# Altium schematic sheet 3v3Regulator.SchDoc
size B; SheetNumber: 5; SheetTotal: 6
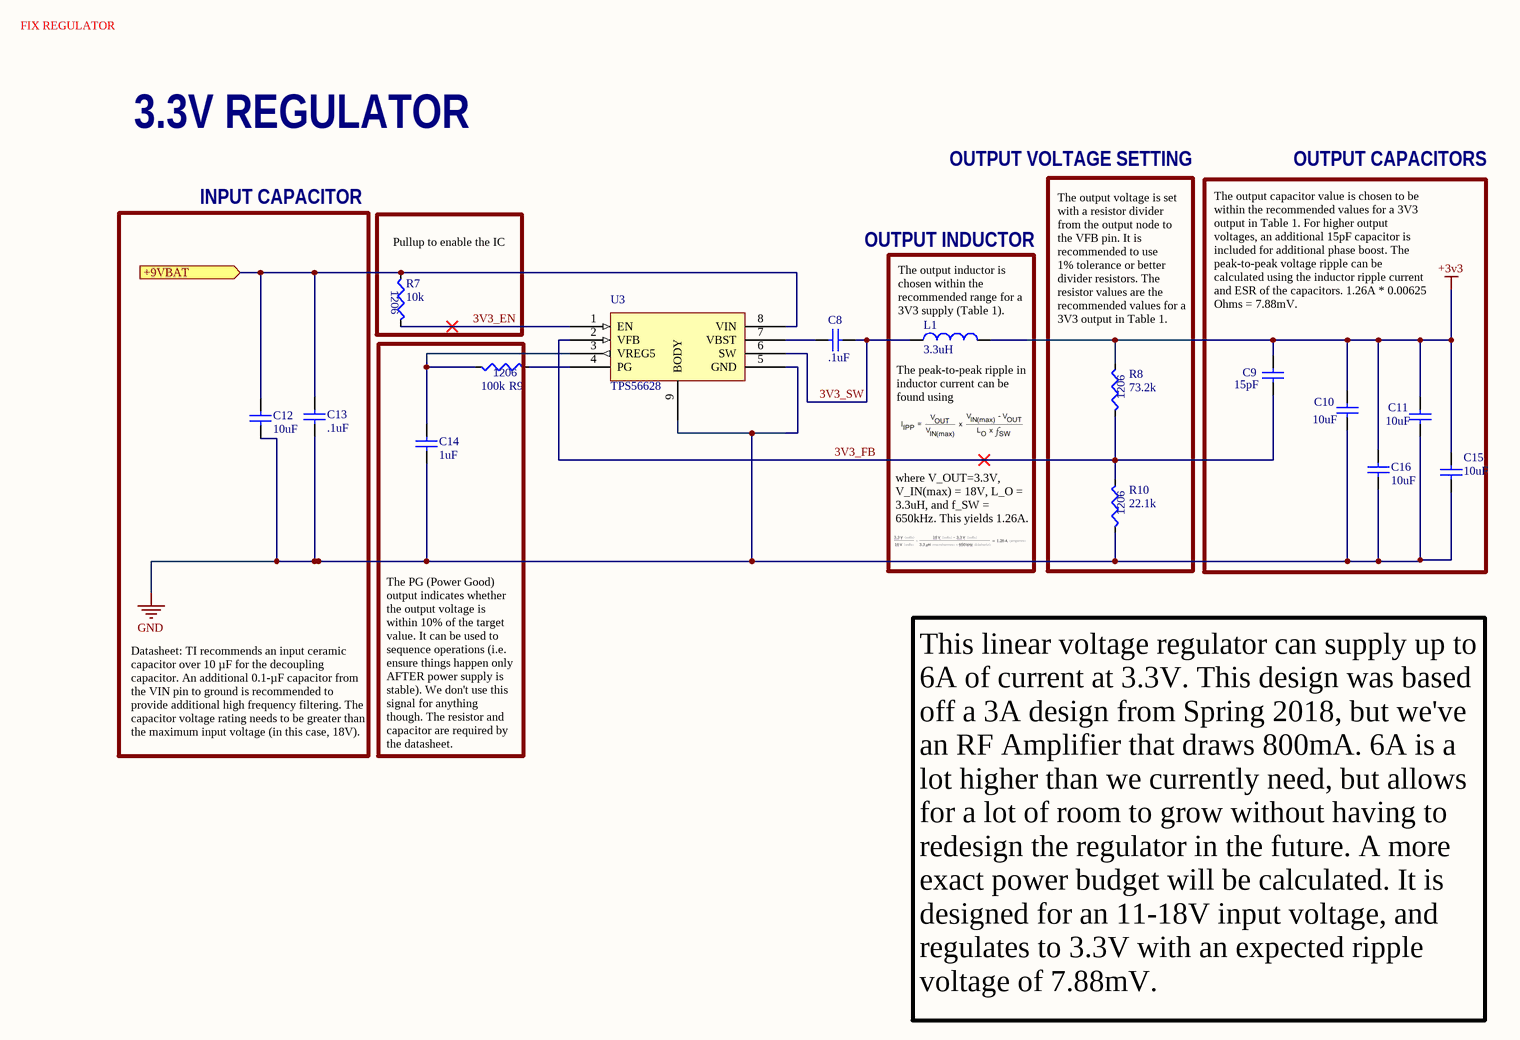
[diagram p0: 3v3Regulator.SchDoc]

## Parts
C8  .1uF  [C1206]
C9  15pF  [C1206]
C10  10uF  [C1206]
C11  10uF  [C1206]
C12  10uF  [C1206]
C13  .1uF  [C1206]
C14  1uF  [C1206]
C15  10uF  [C1206]
C16  10uF  [C1206]
L1  3.3uH  [EATON_DR125]
R7  10k  [R1206]
R8  73.2k  [R1206]
R9  100k  [R1206]
R10  22.1k  [R1206]
U3  TPS56628  [R-PDSO-G8]

## Blocks framed on the sheet
OUTPUT CAPACITORS: C9-C11 C15 C16
INPUT CAPACITOR: C12 C13

## Ports
+9VBAT (in)

## Nets
+3v3: C9.2 C10.2 C11.2 C15.2 C16.2 L1.2 R8.2
GND: C10.1 C11.1 C12.1 C13.1 C14.1 C15.1 C16.1 R10.1 U3.5(GND) U3.9(BODY)
3V3_EN: R7.2 U3.1(EN)
3V3_FB: C9.1 R8.1 R10.2 U3.2(VFB)
3V3_SW: C8.1 L1.1 U3.6(SW)
+9VBAT: C12.2 C13.2 R7.1 U3.8(VIN) ; port +9VBAT
NetC8_2: C8.2 U3.7(VBST)
NetC14_2: C14.2 R9.1 U3.3(VREG5)
NetR9_2: R9.2 U3.4(PG)

## Notes on the sheet
- FIX REGULATOR
- 3.3V REGULATOR
- OUTPUT VOLTAGE SETTING
- (near R7) Pullup to enable the IC
- OUTPUT INDUCTOR
- (near L1) The output inductor is chosen within the recommended range for a 3V3 supply (Table 1).
- (near R8) The output voltage is set with a resistor divider from the output node to the VFB pin. It is recommended to use
  1% tolerance or better divider resistors. The resistor values are the recommended values for a 3V3 output in Table 1.
- (near C9) The output capacitor value is chosen to be within the recommended values for a 3V3 output in Table 1. For higher output voltages, an additional 15pF capacitor is included for additional phase boost. The peak-to-peak voltage ripple can be calculated using the inductor ripple current and ESR of the capacitors. 1.26A * 0.00625 Ohms = 7.88mV.
- (near L1) The peak-to-peak ripple in inductor current can be found using
- where V_OUT=3.3V, V_IN(max) = 18V, L_O = 3.3uH, and f_SW = 650kHz. This yields 1.26A.
- Datasheet: TI recommends an input ceramic capacitor over 10 µF for the decoupling capacitor. An additional 0.1-µF capacitor from the VIN pin to ground is recommended to provide additional high frequency filtering. The capacitor voltage rating needs to be greater than the maximum input voltage (in this case, 18V).
- The PG (Power Good) output indicates whether the output voltage is within 10% of the target value. It can be used to sequence operations (i.e. ensure things happen only AFTER power supply is stable). We don't use this signal for anything though. The resistor and capacitor are required by the datasheet.
- This linear voltage regulator can supply up to 6A of current at 3.3V. This design was based off a 3A design from Spring 2018, but we've an RF Amplifier that draws 800mA. 6A is a lot higher than we currently need, but allows for a lot of room to grow without having to redesign the regulator in the future. A more exact power budget will be calculated. It is designed for an 11-18V input voltage, and regulates to 3.3V with an expected ripple voltage of 7.88mV.
- (in symbol ERJ-8ENF1002V) 1206
- (in symbol ERJ-8ENF1003V) 1206
- (in symbol ERJ-8ENF2212V) 1206
- (in symbol ERJ-8ENF7322V) 1206

## Library data of the parts
C8 C13 = CL31B104KBCNNNC: CAP CER 0.1UF 50V C0G/NP0 1206; Made By: Brennan Swanton; Reviewed By: Carter Allen; Supplier 1: Digi-Key; Supplier Part Number 1: 490-8335-1-ND
C9 = C1206C150K5GACTU: CAP CER 15PF 50V C0G/NP0 1206; Supplier 1: Digi-Key; Supplier Part Number 1: 399-9314-1-ND
C10-C12 C15 C16 = CL31B106KLHNNNE: CER 10UF 35V X7R 1206; Made By: Brennan Swanton; Reviewed By: Carter Allen; Supplier 1: Digi-Key; Supplier Part Number 1: 587-3007-1-ND
C14 = CL31B105KBHNNNE: CER 1UF 50V X7R 1206; Made By: Brennan Swanton; Reviewed By: Carter Allen; Supplier 1: Digi-Key; Supplier Part Number 1: 399-8147-1-ND
L1 = DR125-3R3-R: Inductor 3.3uH 9.26A 20%; Supplier 1: Digi-Key; Supplier Part Number 1: 513-1529-1-ND
R7 = ERJ-8ENF1002V: 10K OHM 1% 1/4W 1206; Made By: Brennan Swanton; Reviewed By: Carter Allen; Supplier 1: Digi-Key; Supplier Part Number 1: 541-2247-1-ND
R8 = ERJ-8ENF7322V: 73.2K OHM 1% 1/4W 1206; Made By: Raphael Navarro; Reviewed By: No one, yet; Supplier 1: Digi-Key; Supplier Part Number 1: P73.2KFCT-ND
R9 = ERJ-8ENF1003V: 100K OHM 1% 1/4W 1206; Made By: Brennan Swanton; Reviewed By: Carter Allen; Supplier 1: Digi-Key; Supplier Part Number 1: P100KFCT-ND
R10 = ERJ-8ENF2212V: 22.1K OHM 1% 1/4W 1206; Supplier 1: Digi-Key; Supplier Part Number 1: P22.1KFCT-ND
U3 = TPS56628: Buck Regulator IC Adj. 6A 4.5V-18V Input; Supplier 1: Digi-Key; Supplier Part Number 1: 296-40815-1-ND